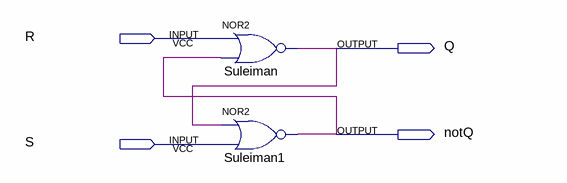
[diagram p0: schematic sheet]
// Quartus schematic SR_Latch.bdf as structural Verilog: 2 symbols, 4 pins
module SR_Latch (
  input  R,
  input  S,
  output Q,
  output notQ
);

  nor Suleiman (Q, R, notQ);
  nor Suleiman1 (notQ, Q, S);
endmodule
